# EAGLE design 00A-110 (EAGLE 9.6.2)
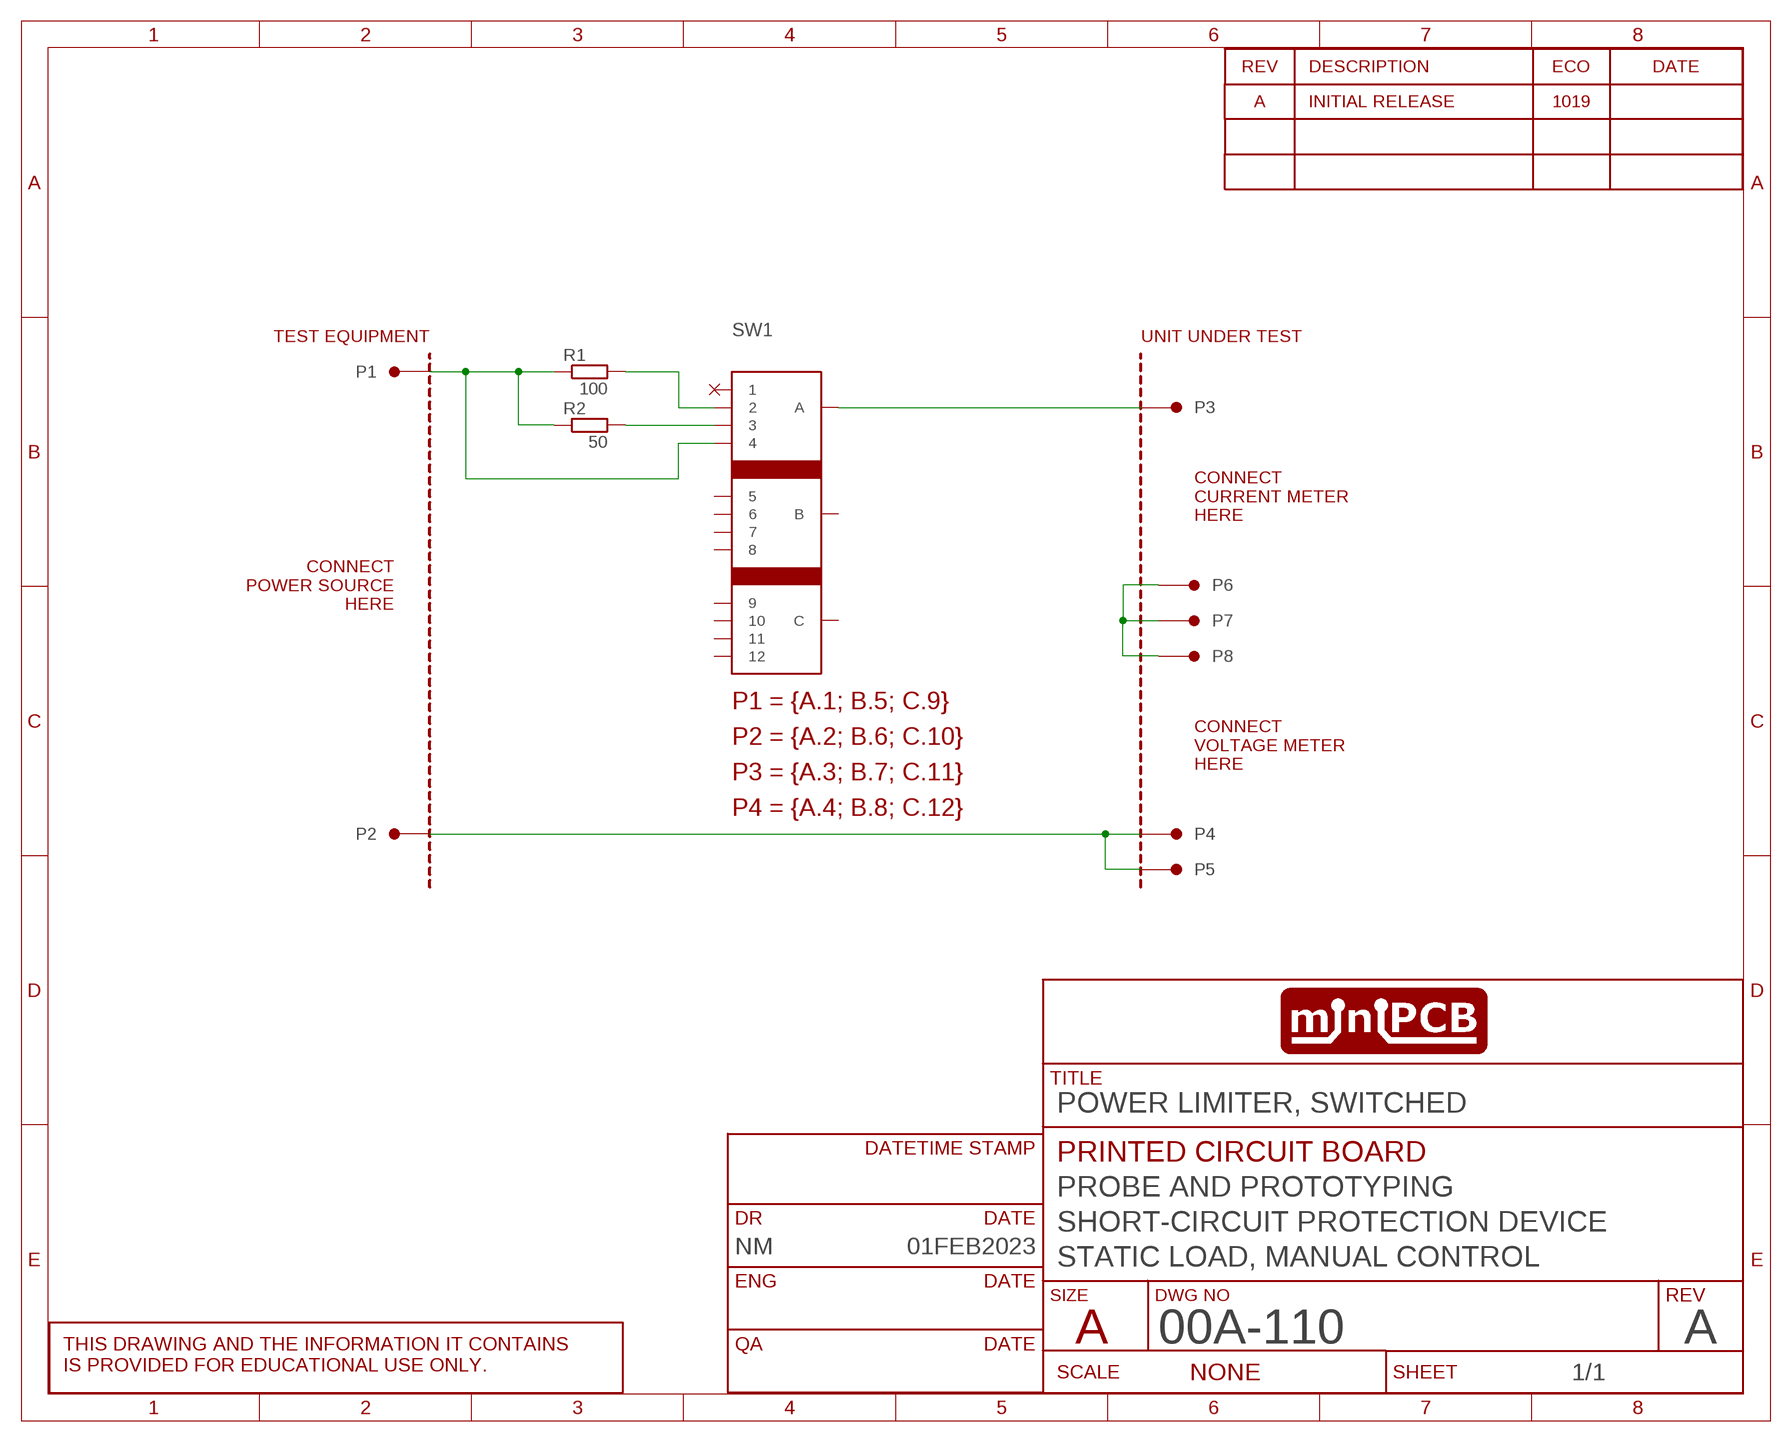
[diagram p0: schematic, sheet 1]
SHEET1 (SCHEMATIC): CIRCUIT_CATEGORY: PROBE AND PROTOTYPING; CIRCUIT_NAME: SHORT-CIRCUIT PROTECTION DEVICE; CIRCUIT_VARIANT: STATIC LOAD, MANUAL CONTROL; DR: NM; DR_DATE: 01FEB2023; PCB_PCBA: PRINTED CIRCUIT BOARD; REVA: A; REVA_ECO: 1019; REVISION: A; TITLE: POWER LIMITER, SWITCHED

## Parts
P1  PINS_15699-0  [BANANAPOST]
P2  PINS_15699-0  [BANANAPOST]
P3  PINS_1KE6060  [PINS_1_KE6060]
P4  PINS_1KE6060  [PINS_1_KE6060]
P5  PINS_15699-0  [BANANAPOST]
P6  PINS_1KE6060  [PINS_1_KE6060]
P7  PINS_1KE6060  [PINS_1_KE6060]
P8  PINS_15699-0  [BANANAPOST]
PCB1  MINIPCB_0P50X50  [MINIPCB_0P_50X50MM]
R1  100  RESISTOR15MM  [R-THD-15MM]
R2  50  RESISTOR15MM  [R-THD-15MM]
SW1  SWITCH-ROTARY-3P4T  [SWITCH-ROTARY-3P4T]

## Nets
N$1: P2.1 P4.1 P4.2 P5.1
N$2: P1.1 R1.1 R2.1 SW1.4
N$3: R1.2 SW1.2
N$4: R2.2 SW1.3
N$5: P6.1 P6.2 P7.1 P7.2 P8.1
N$6: P3.1 P3.2 SW1.A
Unconnected: SW1.1 SW1.5 SW1.6 SW1.7 SW1.8 SW1.9 SW1.10 SW1.11 SW1.12 SW1.B SW1.C

## Notes on the sheet
- CONNECT
  CURRENT METER
  HERE
- CONNECT
  POWER SOURCE
  HERE
- CONNECT
  VOLTAGE METER
  HERE

## Library data of the parts
P1-P8 = minipcb:PINS_1
PCB1 = minipcb:MINIPCB_0P; PART_NUMBER: 00A-110-A; REVISION: A
R1 R2 = minipcb:RESISTOR
SW1 = minipcb:SWITCH-ROTARY-3P4T

## Board
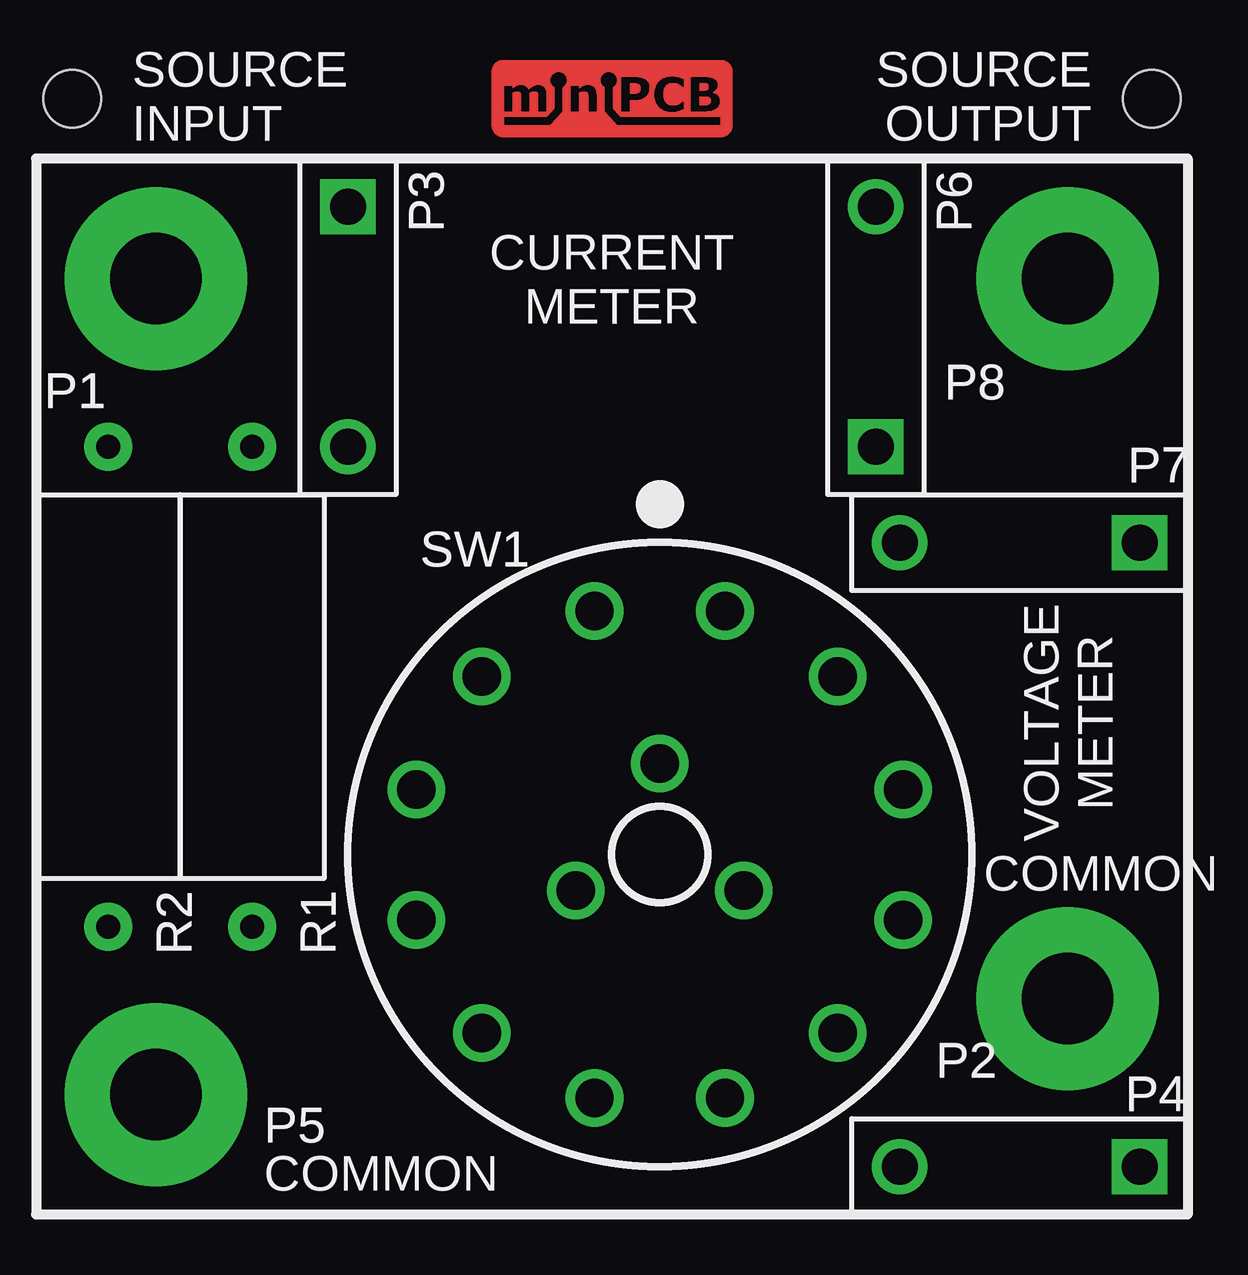
[diagram p1: board, top side]
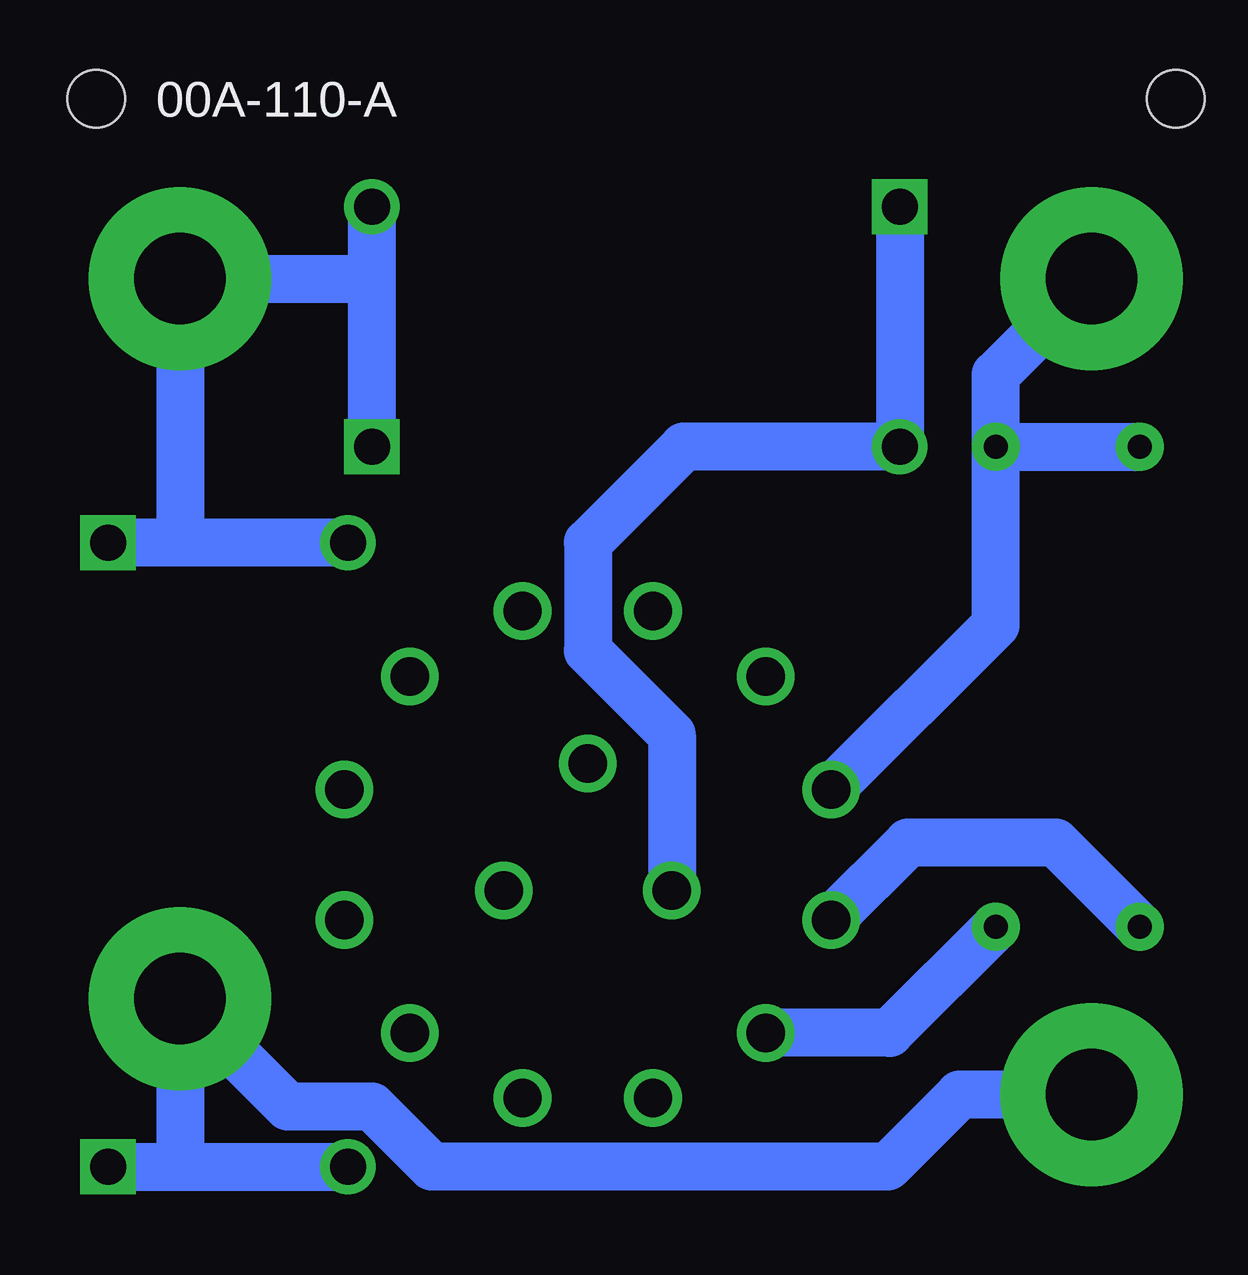
[diagram p2: board, bottom side, seen from below]

No outline drawn. Coordinates in mm, seen from the top.
Copper layers (1*16): Top 0.035mm / dielectric 1.5mm / Bottom 0.035mm
Design rules "minipcb": minimum track width 0.2mm, minimum drill 0.5mm, track to track 0.25mm, track to pad 0.5mm, pad to pad 0.5mm, via to via 0.5mm, smd to smd 0.15mm, copper to edge 1mm, drill to drill 1mm, minimum pad ring 0.4mm, minimum via ring 0.4mm, stop-mask expansion 0.1mm, vias tented up to drill 0.6mm, thermal gap 0.5mm

### Footprints (pad centres in the part's own frame; a part is rotated, then mirrored left to right if it is on the bottom)
BANANAPOST = drill 3.81 pad 7.62: 1 0,0
PINS_1_KE6060 = drill 1.5 square: 1 -5,0 | drill 1.5: 2 5,0
MINIPCB_0P_50X50MM = hole 2.4: 47.5,47.5; 2.5,47.5
R-THD-15MM = drill 1 pad 2: 1 -10,0; 2 10,0
SWITCH-ROTARY-3P4T = drill 1.6: 1 -2.718,-10.142; 2 -7.425,-7.425; 3 -10.142,-2.718; 4 -10.142,2.718; 5 -7.425,7.425; 6 -2.718,10.142; 7 2.718,10.142; 8 7.425,7.425; 9 10.142,2.718; 10 10.142,-2.718; 11 7.425,-7.425; 12 2.718,-10.142; A -3.5,-1.5; B 0,3.8; C 3.5,-1.5

### Placement (x,y rotation side)
P1  6,40 0 top
P2  44,10 0 top
P3  14,38 270 top
P4  42,3 180 top
P5  6,6 0 top
P6  36,38 90 top
P7  42,29 180 top
P8  44,40 0 top
PCB1  0,0 0 top
R1  10,23 270 top
R2  4,23 270 top
SW1  27,16 0 top

### Tracks (layer width: path | path; a pad name or v marks a point on that pad's centre or on a via)
N$1
  Bottom 2: P5.1 11.5,6 14.5,3 33.5,3 36,5.5 39.5,5.5 P2.1 44,3 P4.2 P4.1
N$2
  Bottom 2: SW1.4 10,25.57 R1.1 | R1.1 10,36 P1.1 | R1.1 R2.1
N$3
  Bottom 2: R1.2 14.43,8.57 SW1.2
N$4
  Bottom 2: R2.2 7.5,16.5 13.64,16.5 SW1.3
N$5
  Bottom 2: P6.1 36,40 | 36,40 P6.2 | 36,40 P8.1 44,29 | P7.2 44,29 | 44,29 P7.1
N$6
  Bottom 2: SW1.A 23.5,21 27,24.5 27,29 23,33 P3.2 P3.1

### Text on the board
tPlace: SOURCE / INPUT | SOURCE / OUTPUT | CURRENT / METER | VOLTAGE / METER | COMMON | COMMON
_tNames: P3 | P6 | P1 | P8 | P7 | SW1 | R2 | R1 | P2 | P4 | P5